# Altium project MAGI'sCore-MBH.PrjPCB
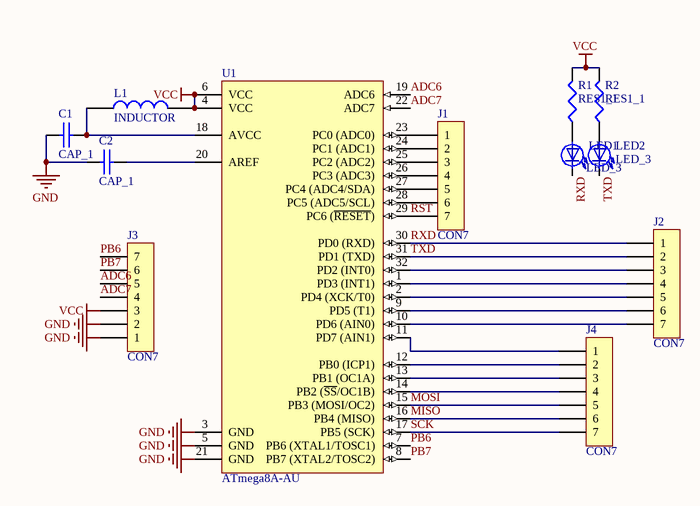
[diagram p0: MAGI'sCore-MBH.SchDoc]
1 sheet, 12 parts. Net scope: global (net labels, ports and power ports of the same name join across sheets).
Board file: MAGI'sCore-MBH.PcbDoc

## Sheet MAGI'sCore-MBH.SchDoc
size A4

### Parts
C1  CAP_1  [1210]
C2  CAP_1  [1210]
J1  CON7  [CON7]
J2  CON7  [CON7]
J3  CON7  [CON7]
J4  CON7  [CON7]
L1  INDUCTOR  [22uh]
LED1  LED_3  [0805]
LED2  LED_3  [0805]
R1  RES1_1  [0805]
R2  RES1_1  [0805]
U1  ATmega8A-AU  [32A_N]

### Nets
GND: C1.1 C2.1 J3.1 J3.2 U1.3(GND) U1.5(GND) U1.21(GND)
VCC: J3.3 L1.2 R1.2 R2.2 U1.4(VCC) U1.6(VCC)
ADC6: J3.5 U1.19(ADC6)
ADC7: J3.4 U1.22(ADC7)
MISO: J4.6 U1.16(PB4_(MISO))
MOSI: J4.5 U1.15(PB3_(MOSI/OC2))
PB6: J3.7 U1.7(PB6_(XTAL1/TOSC1))
PB7: J3.6 U1.8(PB7_(XTAL2/TOSC2))
RST: J1.7 U1.29(PC6_(~{RESET}))
RXD: J2.1 LED1.2(K) U1.30(PD0_(RXD))
SCK: J4.7 U1.17(PB5_(SCK))
TXD: J2.2 LED2.2(K) U1.31(PD1_(TXD))
NetC1_2: C1.2 L1.1 U1.18(AVCC)
NetC2_2: C2.2 U1.20(AREF)
NetJ1_1: J1.1 U1.23(PC0_(ADC0))
NetJ1_2: J1.2 U1.24(PC1_(ADC1))
NetJ1_3: J1.3 U1.25(PC2_(ADC2))
NetJ1_4: J1.4 U1.26(PC3_(ADC3))
NetJ1_5: J1.5 U1.27(PC4_(ADC4/SDA))
NetJ1_6: J1.6 U1.28(PC5_(ADC5/SCL))
NetJ2_3: J2.3 U1.32(PD2_(INT0))
NetJ2_4: J2.4 U1.1(PD3_(INT1))
NetJ2_5: J2.5 U1.2(PD4_(XCK/T0))
NetJ2_6: J2.6 U1.9(PD5_(T1))
NetJ2_7: J2.7 U1.10(PD6_(AIN0))
NetJ4_1: J4.1 U1.11(PD7_(AIN1))
NetJ4_2: J4.2 U1.12(PB0_(ICP1))
NetJ4_3: J4.3 U1.13(PB1_(OC1A))
NetJ4_4: J4.4 U1.14(PB2_(~{SS}/OC1B))
NetLED1_1: LED1.1(A) R1.1
NetLED2_1: LED2.1(A) R2.1

### Library data of the parts
C1 C2 = CAP_1: Capacitor
J1-J4 = CON7: Connector
U1 = ATmega8A-AU: 8-bit AVR Microcontroller, 8KB Flash, 512 Bytes EEPROM, 1KB SRAM, 32-pin TQFP, Industrial Grade (-40°C to 85°C); Published: 1-Apr-2010; DatasheetVersion: revC, Jul-2009; PackageVersion: revB, Oct-2001; PackageReference: 32A; Publisher: Altium Limited; PackageDescription: 32-Lead, 7x7x1.0 mm Body, 0.8mm Lead Pitch, Thin Profile Plastic Quad Flat Package (TQFP); Supplier 1: Digi-Key; Supplier Part Number 1: ATMEGA8A-AU-ND; Supplier 2: Farnell; Supplier Part Number 2: 1748532; Supplier 3: Mouser; Supplier Part Number 3: 556-ATMEGA8A-AU; Code_JEDEC: MS-026-ABA; ComponentLink1Description: Manufacturer Link; ComponentLink1URL: http://www.atmel.com/products/avr/default.asp?; ComponentLink2Description: ATmega8A Datasheet; ComponentLink2URL: http://www.atmel.com/dyn/resources/prod_documents/doc8159.pdf; ComponentLink3Description: ATmega8A Summary; ComponentLink3URL: http://www.atmel.com/dyn/resources/prod_documents/8159S.pdf; ComponentLink4Description: Atmel.com Home; ComponentLink4URL: http://www.atmel.com